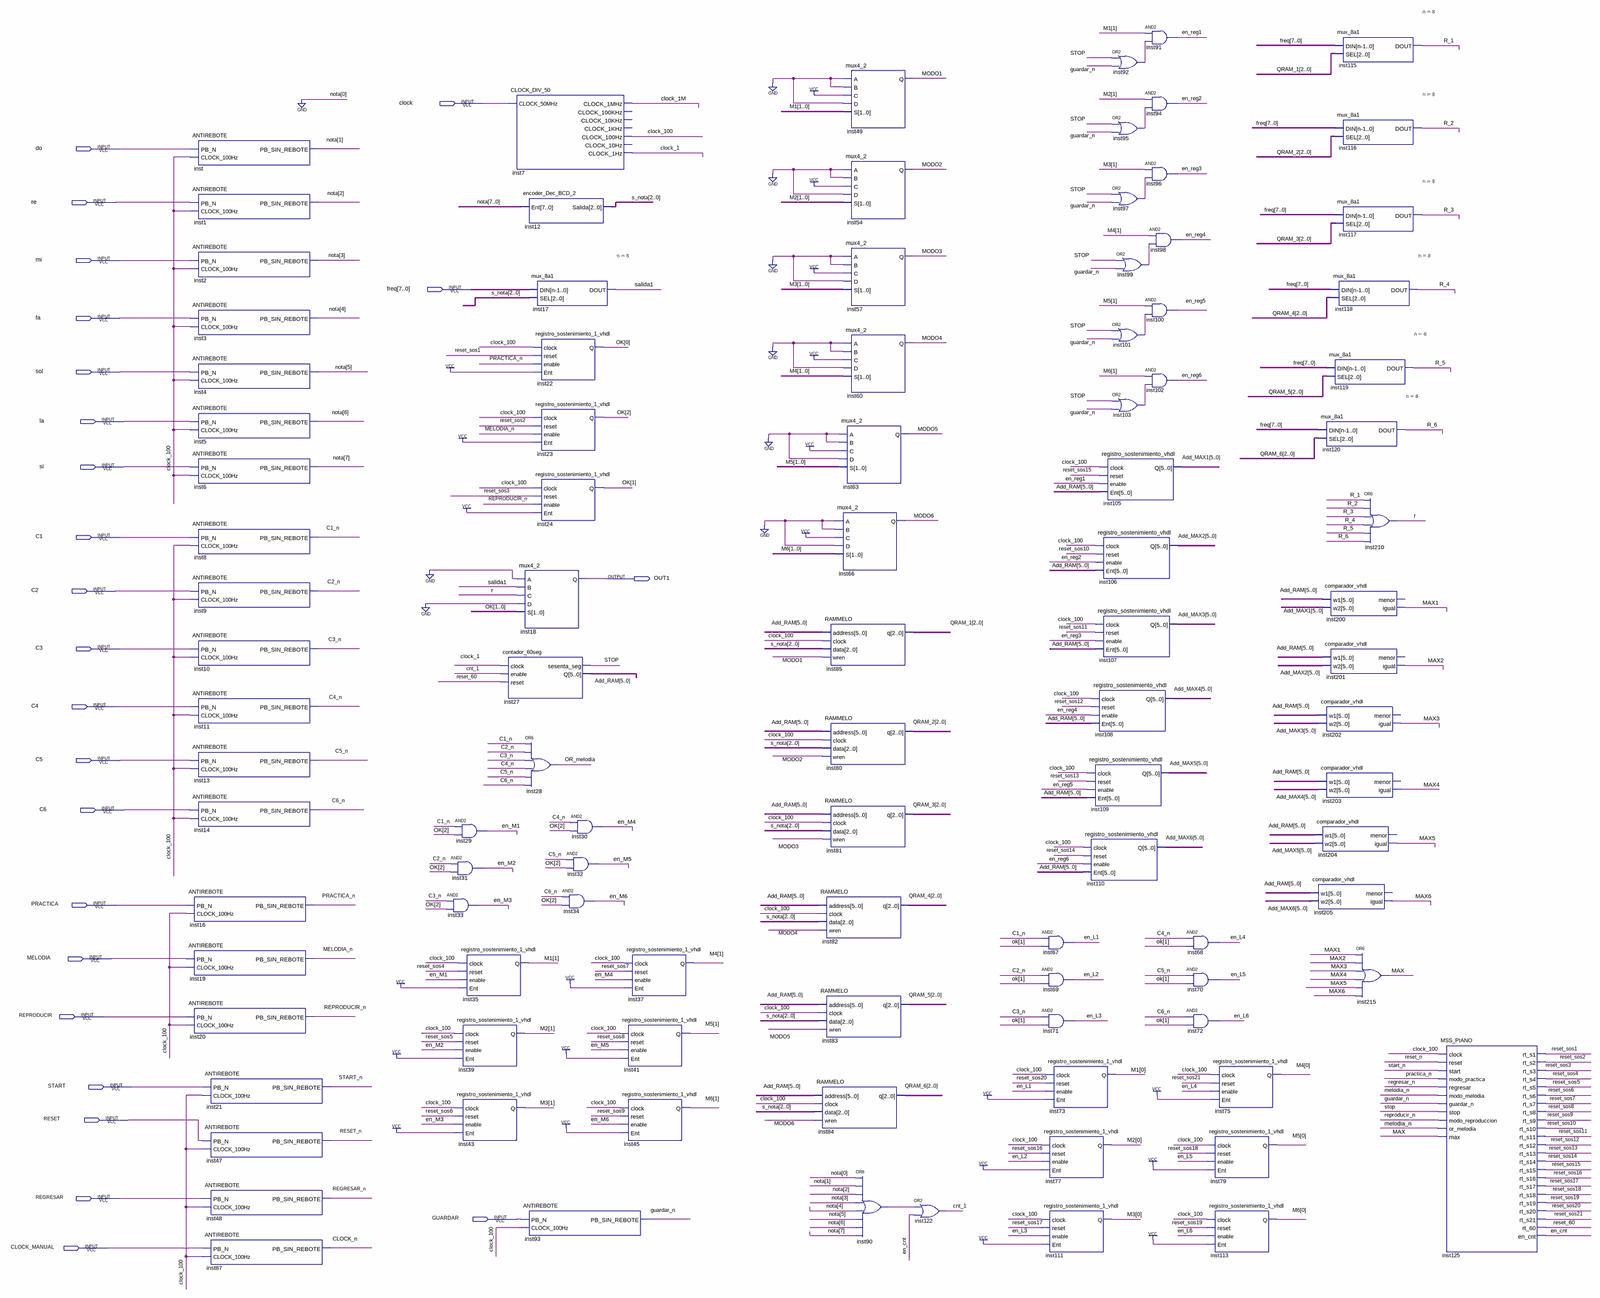
[diagram p0: schematic sheet, whole]
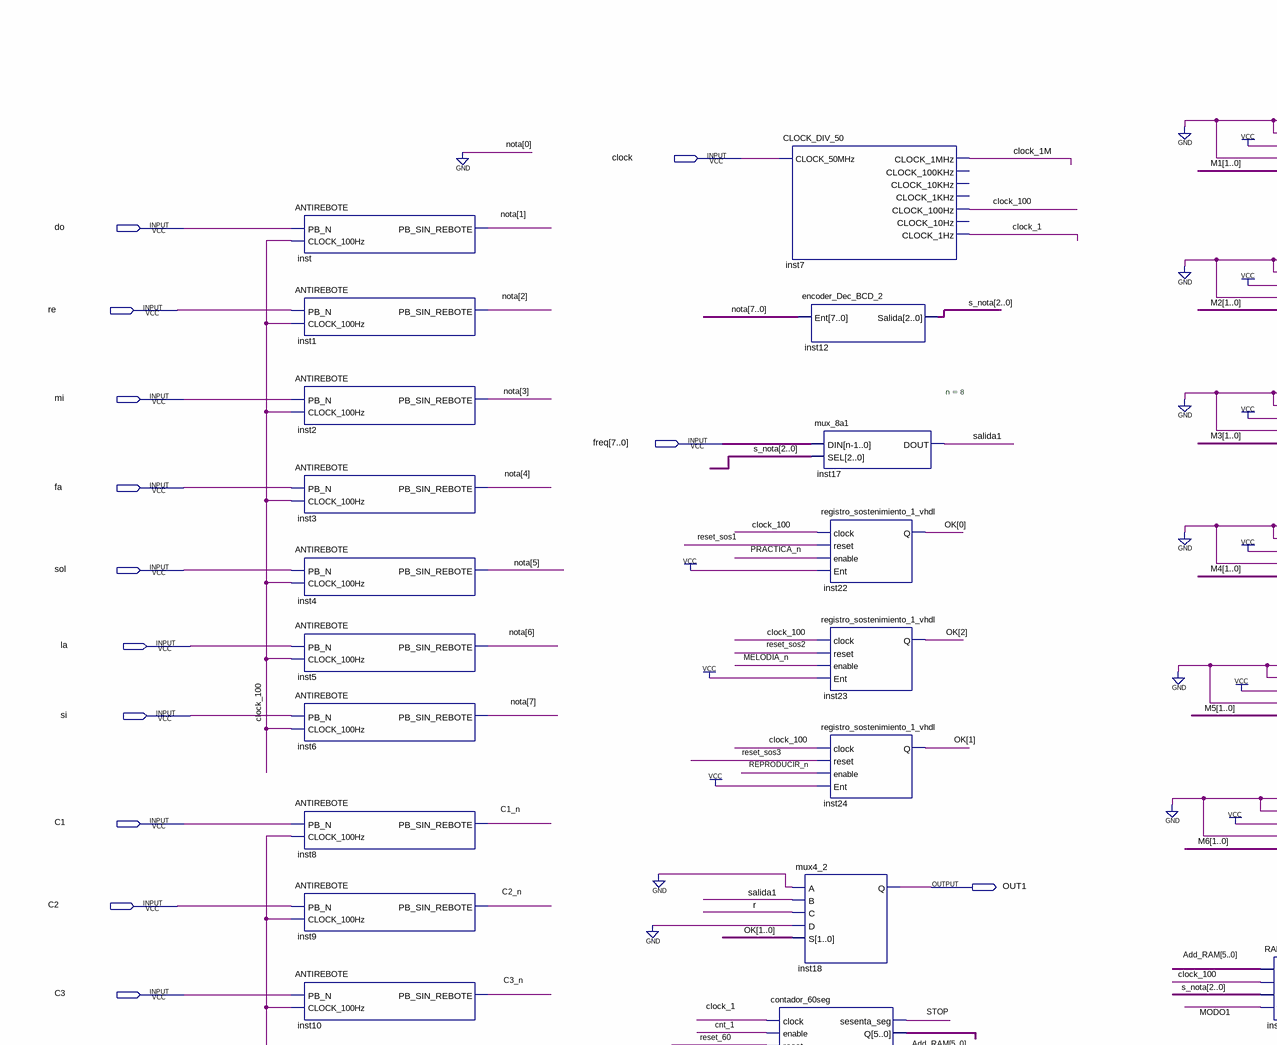
[diagram p1: schematic sheet, upper left part]
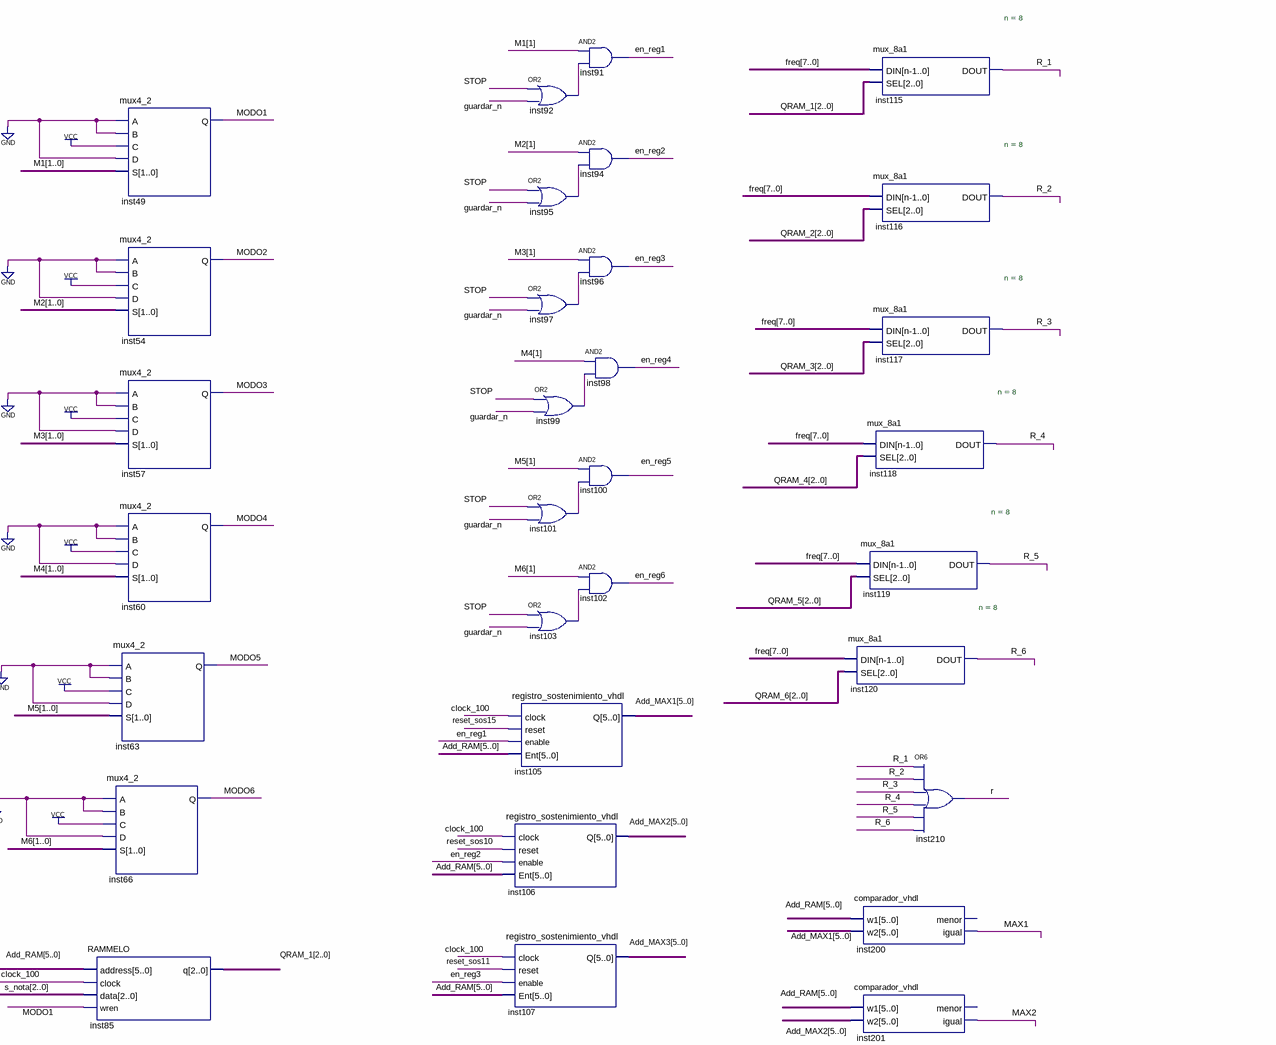
[diagram p2: schematic sheet, upper right part]
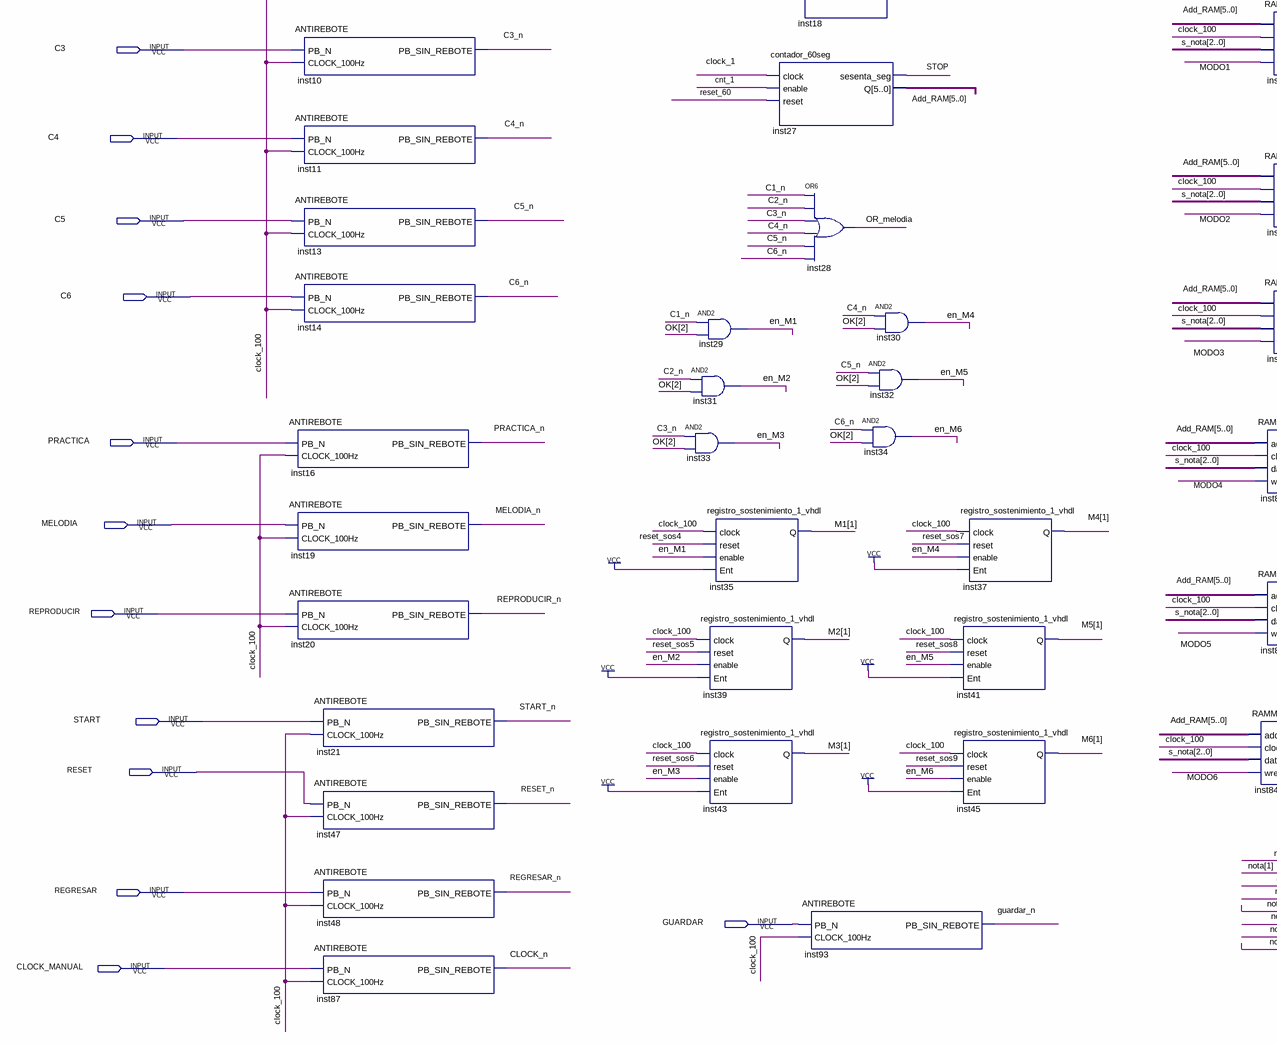
[diagram p3: schematic sheet, lower left part]
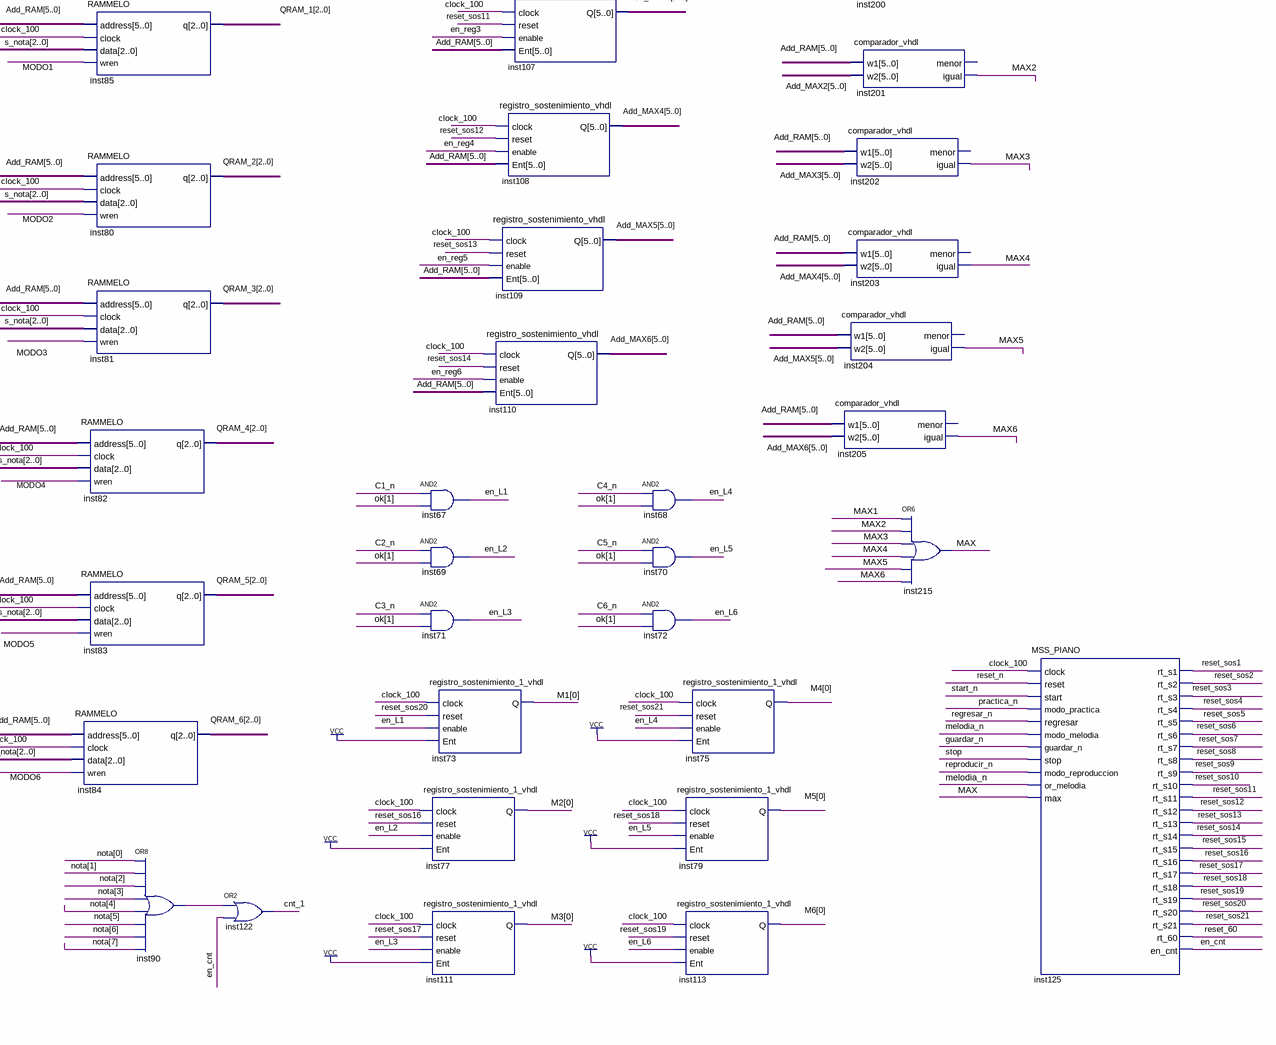
[diagram p4: schematic sheet, lower right part]
// Quartus schematic PIANO2.bdf as structural Verilog: 101 symbols, 24 pins
module PIANO2 (
  input  clock,
  input  \do ,
  input  re,
  input  mi,
  input  [7:0] freq,
  input  fa,
  input  sol,
  input  la,
  input  si,
  input  C1,
  input  C2,
  input  C3,
  input  C4,
  input  C5,
  input  C6,
  input  PRACTICA,
  input  MELODIA,
  input  REPRODUCIR,
  input  START,
  input  RESET,
  input  REGRESAR,
  input  GUARDAR,
  input  CLOCK_MANUAL,
  output OUT1
);

  wire C1_n, C2_n, C3_n, C4_n, C5_n, C6_n, clock_1, clock_1M, clock_100, CLOCK_n, cnt_1, en_cnt, en_L1,
       en_L2, en_L3, en_L4, en_L5, en_L6, en_M1, en_M2, en_M3, en_M4, en_M5, en_M6, en_reg1, en_reg2,
       en_reg3, en_reg4, en_reg5, en_reg6, guardar_n, inst90_out, inst92_out, inst95_out, inst97_out,
       inst99_out, inst101_out, inst103_out, MAX, MAX1, MAX2, MAX3, MAX4, MAX5, MAX6, MELODIA_n, MODO1,
       MODO2, MODO3, MODO4, MODO5, MODO6, OR_melodia, PRACTICA_n, r, R_1, R_2, R_3, R_4, R_5, R_6,
       REGRESAR_n, REPRODUCIR_n, reset_60, RESET_n, reset_sos1, reset_sos2, reset_sos3, reset_sos4,
       reset_sos5, reset_sos6, reset_sos7, reset_sos8, reset_sos9, reset_sos10, reset_sos11, reset_sos12,
       reset_sos13, reset_sos14, reset_sos15, reset_sos16, reset_sos17, reset_sos18, reset_sos19,
       reset_sos20, reset_sos21, salida1, START_n, STOP;
  wire [1:0] M1, M2, M3, M4, M5, M6;
  wire [2:0] OK, QRAM_1, QRAM_2, QRAM_3, QRAM_4, QRAM_5, QRAM_6, s_nota;
  wire [5:0] Add_MAX1, Add_MAX2, Add_MAX3, Add_MAX4, Add_MAX5, Add_MAX6, Add_RAM;
  wire [7:1] nota;

  ANTIREBOTE inst (.PB_N(\do ), .CLOCK_100Hz(clock_100), .PB_SIN_REBOTE(nota[1]));
  ANTIREBOTE inst1 (.PB_N(re), .CLOCK_100Hz(clock_100), .PB_SIN_REBOTE(nota[2]));
  ANTIREBOTE inst2 (.PB_N(mi), .CLOCK_100Hz(clock_100), .PB_SIN_REBOTE(nota[3]));
  ANTIREBOTE inst3 (.PB_N(fa), .CLOCK_100Hz(clock_100), .PB_SIN_REBOTE(nota[4]));
  ANTIREBOTE inst4 (.PB_N(sol), .CLOCK_100Hz(clock_100), .PB_SIN_REBOTE(nota[5]));
  ANTIREBOTE inst5 (.PB_N(la), .CLOCK_100Hz(clock_100), .PB_SIN_REBOTE(nota[6]));
  ANTIREBOTE inst6 (.PB_N(si), .CLOCK_100Hz(clock_100), .PB_SIN_REBOTE(nota[7]));
  ANTIREBOTE inst8 (.PB_N(C1), .CLOCK_100Hz(clock_100), .PB_SIN_REBOTE(C1_n));
  ANTIREBOTE inst9 (.PB_N(C2), .CLOCK_100Hz(clock_100), .PB_SIN_REBOTE(C2_n));
  ANTIREBOTE inst10 (.PB_N(C3), .CLOCK_100Hz(clock_100), .PB_SIN_REBOTE(C3_n));
  ANTIREBOTE inst11 (.PB_N(C4), .CLOCK_100Hz(clock_100), .PB_SIN_REBOTE(C4_n));
  ANTIREBOTE inst13 (.PB_N(C5), .CLOCK_100Hz(clock_100), .PB_SIN_REBOTE(C5_n));
  ANTIREBOTE inst14 (.PB_N(C6), .CLOCK_100Hz(clock_100), .PB_SIN_REBOTE(C6_n));
  ANTIREBOTE inst16 (.PB_N(PRACTICA), .CLOCK_100Hz(clock_100), .PB_SIN_REBOTE(PRACTICA_n));
  ANTIREBOTE inst19 (.PB_N(MELODIA), .CLOCK_100Hz(clock_100), .PB_SIN_REBOTE(MELODIA_n));
  ANTIREBOTE inst20 (.PB_N(REPRODUCIR), .CLOCK_100Hz(clock_100), .PB_SIN_REBOTE(REPRODUCIR_n));
  ANTIREBOTE inst21 (.PB_N(START), .CLOCK_100Hz(clock_100), .PB_SIN_REBOTE(START_n));
  ANTIREBOTE inst47 (.PB_N(RESET), .CLOCK_100Hz(clock_100), .PB_SIN_REBOTE(RESET_n));
  ANTIREBOTE inst48 (.PB_N(REGRESAR), .CLOCK_100Hz(clock_100), .PB_SIN_REBOTE(REGRESAR_n));
  ANTIREBOTE inst87 (.PB_N(CLOCK_MANUAL), .CLOCK_100Hz(clock_100), .PB_SIN_REBOTE(CLOCK_n));
  and inst33 (en_M3, C3_n, OK[2]);
  and inst29 (en_M1, C1_n, OK[2]);
  and inst31 (en_M2, C2_n, OK[2]);
  registro_sostenimiento_1_vhdl inst35 (.clock(clock_100), .reset(reset_sos4), .enable(en_M1), .Ent(1'b1), .Q(M1[1]));
  registro_sostenimiento_1_vhdl inst39 (.clock(clock_100), .reset(reset_sos5), .enable(en_M2), .Ent(1'b1), .Q(M2[1]));
  registro_sostenimiento_1_vhdl inst43 (.clock(clock_100), .reset(reset_sos6), .enable(en_M3), .Ent(1'b1), .Q(M3[1]));
  CLOCK_DIV_50 inst7 (
    .CLOCK_50MHz(clock), .CLOCK_1MHz(clock_1M), .CLOCK_100Hz(clock_100), .CLOCK_1Hz(clock_1));  // open: CLOCK_100KHz, CLOCK_10KHz, CLOCK_1KHz, CLOCK_10Hz
  contador_60seg inst27 (.clock(clock_1), .enable(cnt_1), .reset(reset_60), .sesenta_seg(STOP), .Q(Add_RAM));
  encoder_Dec_BCD_2 inst12 (.Ent({nota, 1'b0}), .Salida(s_nota));
  mux_8a1 #(.n(8)) inst17 (.DIN(freq), .SEL(s_nota), .DOUT(salida1));
  registro_sostenimiento_1_vhdl inst22 (
    .clock(clock_100), .reset(reset_sos1), .enable(PRACTICA_n), .Ent(1'b1), .Q(OK[0]));
  registro_sostenimiento_1_vhdl inst23 (
    .clock(clock_100), .reset(reset_sos2), .enable(MELODIA_n), .Ent(1'b1), .Q(OK[2]));
  registro_sostenimiento_1_vhdl inst24 (
    .clock(clock_100), .reset(reset_sos3), .enable(REPRODUCIR_n), .Ent(1'b1), .Q(OK[1]));
  mux4_2 inst18 (.A(1'b0), .B(salida1), .C(r), .D(1'b0), .S(OK[1:0]), .Q(OUT1));
  or inst28 (OR_melodia, C1_n, C2_n, C3_n, C4_n, C5_n, C6_n);
  ANTIREBOTE inst93 (.PB_N(GUARDAR), .CLOCK_100Hz(clock_100), .PB_SIN_REBOTE(guardar_n));
  and inst30 (en_M4, C4_n, OK[2]);
  and inst32 (en_M5, C5_n, OK[2]);
  and inst34 (en_M6, C6_n, OK[2]);
  registro_sostenimiento_1_vhdl inst37 (.clock(clock_100), .reset(reset_sos7), .enable(en_M4), .Ent(1'b1), .Q(M4[1]));
  registro_sostenimiento_1_vhdl inst41 (.clock(clock_100), .reset(reset_sos8), .enable(en_M5), .Ent(1'b1), .Q(M5[1]));
  registro_sostenimiento_1_vhdl inst45 (.clock(clock_100), .reset(reset_sos9), .enable(en_M6), .Ent(1'b1), .Q(M6[1]));
  mux4_2 inst49 (.A(1'b0), .B(1'b0), .C(1'b1), .D(1'b0), .S(M1), .Q(MODO1));
  mux4_2 inst54 (.A(1'b0), .B(1'b0), .C(1'b1), .D(1'b0), .S(M2), .Q(MODO2));
  mux4_2 inst57 (.A(1'b0), .B(1'b0), .C(1'b1), .D(1'b0), .S(M3), .Q(MODO3));
  mux4_2 inst60 (.A(1'b0), .B(1'b0), .C(1'b1), .D(1'b0), .S(M4), .Q(MODO4));
  mux4_2 inst63 (.A(1'b0), .B(1'b0), .C(1'b1), .D(1'b0), .S(M5), .Q(MODO5));
  mux4_2 inst66 (.A(1'b0), .B(1'b0), .C(1'b1), .D(1'b0), .S(M6), .Q(MODO6));
  RAMMELO inst85 (.address(Add_RAM), .clock(clock_100), .data(s_nota), .wren(MODO1), .q(QRAM_1));
  RAMMELO inst80 (.address(Add_RAM), .clock(clock_100), .data(s_nota), .wren(MODO2), .q(QRAM_2));
  RAMMELO inst81 (.address(Add_RAM), .clock(clock_100), .data(s_nota), .wren(MODO3), .q(QRAM_3));
  RAMMELO inst82 (.address(Add_RAM), .clock(clock_100), .data(s_nota), .wren(MODO4), .q(QRAM_4));
  RAMMELO inst83 (.address(Add_RAM), .clock(clock_100), .data(s_nota), .wren(MODO5), .q(QRAM_5));
  RAMMELO inst84 (.address(Add_RAM), .clock(clock_100), .data(s_nota), .wren(MODO6), .q(QRAM_6));
  or inst90 (inst90_out, 1'b0, nota[1], nota[2], nota[3], nota[4], nota[5], nota[6], nota[7]);
  or inst122 (cnt_1, inst90_out, en_cnt);
  and inst67 (en_L1, C1_n, OK[1]);
  and inst69 (en_L2, C2_n, OK[1]);
  and inst71 (en_L3, C3_n, OK[1]);
  registro_sostenimiento_1_vhdl inst77 (.clock(clock_100), .reset(reset_sos16), .enable(en_L2), .Ent(1'b1), .Q(M2[0]));
  registro_sostenimiento_1_vhdl inst111 (.clock(clock_100), .reset(reset_sos17), .enable(en_L3), .Ent(1'b1), .Q(M3[0]));
  registro_sostenimiento_1_vhdl inst73 (.clock(clock_100), .reset(reset_sos20), .enable(en_L1), .Ent(1'b1), .Q(M1[0]));
  registro_sostenimiento_vhdl inst105 (
    .clock(clock_100), .reset(reset_sos15), .enable(en_reg1), .Ent(Add_RAM), .Q(Add_MAX1));
  registro_sostenimiento_vhdl inst106 (
    .clock(clock_100), .reset(reset_sos10), .enable(en_reg2), .Ent(Add_RAM), .Q(Add_MAX2));
  registro_sostenimiento_vhdl inst107 (
    .clock(clock_100), .reset(reset_sos11), .enable(en_reg3), .Ent(Add_RAM), .Q(Add_MAX3));
  registro_sostenimiento_vhdl inst108 (
    .clock(clock_100), .reset(reset_sos12), .enable(en_reg4), .Ent(Add_RAM), .Q(Add_MAX4));
  registro_sostenimiento_vhdl inst109 (
    .clock(clock_100), .reset(reset_sos13), .enable(en_reg5), .Ent(Add_RAM), .Q(Add_MAX5));
  registro_sostenimiento_vhdl inst110 (
    .clock(clock_100), .reset(reset_sos14), .enable(en_reg6), .Ent(Add_RAM), .Q(Add_MAX6));
  or inst92 (inst92_out, STOP, guardar_n);
  or inst95 (inst95_out, STOP, guardar_n);
  or inst97 (inst97_out, STOP, guardar_n);
  or inst99 (inst99_out, STOP, guardar_n);
  or inst101 (inst101_out, STOP, guardar_n);
  or inst103 (inst103_out, STOP, guardar_n);
  and inst91 (en_reg1, M1[1], inst92_out);
  and inst94 (en_reg2, M2[1], inst95_out);
  and inst96 (en_reg3, M3[1], inst97_out);
  and inst98 (en_reg4, M4[1], inst99_out);
  and inst100 (en_reg5, M5[1], inst101_out);
  and inst102 (en_reg6, M6[1], inst103_out);
  and inst68 (en_L4, C4_n, OK[1]);
  and inst70 (en_L5, C5_n, OK[1]);
  and inst72 (en_L6, C6_n, OK[1]);
  registro_sostenimiento_1_vhdl inst79 (.clock(clock_100), .reset(reset_sos18), .enable(en_L5), .Ent(1'b1), .Q(M5[0]));
  registro_sostenimiento_1_vhdl inst113 (.clock(clock_100), .reset(reset_sos19), .enable(en_L6), .Ent(1'b1), .Q(M6[0]));
  registro_sostenimiento_1_vhdl inst75 (.clock(clock_100), .reset(reset_sos21), .enable(en_L4), .Ent(1'b1), .Q(M4[0]));
  mux_8a1 #(.n(8)) inst115 (.DIN(freq), .SEL(QRAM_1), .DOUT(R_1));
  mux_8a1 #(.n(8)) inst116 (.DIN(freq), .SEL(QRAM_2), .DOUT(R_2));
  mux_8a1 #(.n(8)) inst117 (.DIN(freq), .SEL(QRAM_3), .DOUT(R_3));
  mux_8a1 #(.n(8)) inst118 (.DIN(freq), .SEL(QRAM_4), .DOUT(R_4));
  mux_8a1 #(.n(8)) inst119 (.DIN(freq), .SEL(QRAM_5), .DOUT(R_5));
  mux_8a1 #(.n(8)) inst120 (.DIN(freq), .SEL(QRAM_6), .DOUT(R_6));
  comparador_vhdl inst200 (.w1(Add_RAM), .w2(Add_MAX1), .igual(MAX1));  // open: menor
  comparador_vhdl inst201 (.w1(Add_RAM), .w2(Add_MAX2), .igual(MAX2));  // open: menor
  comparador_vhdl inst202 (.w1(Add_RAM), .w2(Add_MAX3), .igual(MAX3));  // open: menor
  comparador_vhdl inst203 (.w1(Add_RAM), .w2(Add_MAX4), .igual(MAX4));  // open: menor
  comparador_vhdl inst204 (.w1(Add_RAM), .w2(Add_MAX5), .igual(MAX5));  // open: menor
  comparador_vhdl inst205 (.w1(Add_RAM), .w2(Add_MAX6), .igual(MAX6));  // open: menor
  or inst210 (r, R_1, R_2, R_3, R_4, R_5, R_6);
  or inst215 (MAX, MAX1, MAX2, MAX3, MAX4, MAX5, MAX6);
  MSS_PIANO inst125 (
    .clock(clock_100), .reset(RESET_n), .start(START_n), .modo_practica(PRACTICA_n), .regresar(REGRESAR_n),
    .modo_melodia(MELODIA_n), .guardar_n(guardar_n), .stop(STOP), .modo_reproduccion(REPRODUCIR_n),
    .or_melodia(MELODIA_n), .max(MAX), .rt_s1(reset_sos1), .rt_s2(reset_sos2), .rt_s3(reset_sos3),
    .rt_s4(reset_sos4), .rt_s5(reset_sos5), .rt_s6(reset_sos6), .rt_s7(reset_sos7), .rt_s8(reset_sos8),
    .rt_s9(reset_sos9), .rt_s10(reset_sos10), .rt_s11(reset_sos11), .rt_s12(reset_sos12),
    .rt_s13(reset_sos13), .rt_s14(reset_sos14), .rt_s15(reset_sos15), .rt_s16(reset_sos16),
    .rt_s17(reset_sos17), .rt_s18(reset_sos18), .rt_s19(reset_sos19), .rt_s20(reset_sos20),
    .rt_s21(reset_sos21), .rt_60(reset_60), .en_cnt(en_cnt));
endmodule
